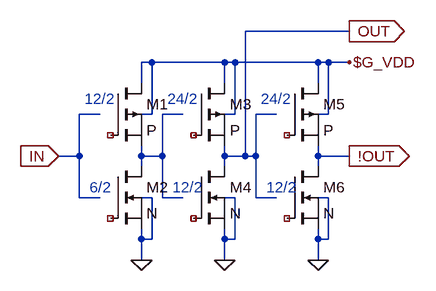
[diagram p0: schematic buf2.asc]
buf2.asc, the LTspice schematic file:
Version 4
SHEET 1 1292 836
WIRE -240 -144 -400 -144
WIRE -544 -96 -560 -96
WIRE -432 -96 -544 -96
WIRE -416 -96 -432 -96
WIRE -288 -96 -416 -96
WIRE -272 -96 -288 -96
WIRE -240 -96 -272 -96
WIRE -560 -64 -560 -96
WIRE -432 -64 -432 -96
WIRE -288 -64 -288 -96
WIRE -624 -16 -656 -16
WIRE -544 -16 -544 -96
WIRE -544 -16 -560 -16
WIRE -496 -16 -528 -16
WIRE -416 -16 -416 -96
WIRE -416 -16 -432 -16
WIRE -352 -16 -384 -16
WIRE -272 -16 -272 -96
WIRE -272 -16 -288 -16
WIRE -656 48 -656 -16
WIRE -656 48 -688 48
WIRE -560 48 -560 32
WIRE -528 48 -528 -16
WIRE -528 48 -560 48
WIRE -432 48 -432 32
WIRE -400 48 -400 -144
WIRE -400 48 -432 48
WIRE -384 48 -384 -16
WIRE -384 48 -400 48
WIRE -288 48 -288 32
WIRE -240 48 -288 48
WIRE -560 64 -560 48
WIRE -432 64 -432 48
WIRE -288 64 -288 48
WIRE -656 112 -656 48
WIRE -624 112 -656 112
WIRE -544 112 -560 112
WIRE -528 112 -528 48
WIRE -496 112 -528 112
WIRE -416 112 -432 112
WIRE -384 112 -384 48
WIRE -352 112 -384 112
WIRE -272 112 -288 112
WIRE -560 176 -560 160
WIRE -544 176 -544 112
WIRE -544 176 -560 176
WIRE -432 176 -432 160
WIRE -416 176 -416 112
WIRE -416 176 -432 176
WIRE -288 176 -288 160
WIRE -272 176 -272 112
WIRE -272 176 -288 176
WIRE -560 208 -560 176
WIRE -432 208 -432 176
WIRE -288 208 -288 176
FLAG -560 208 0
FLAG -688 48 IN
IOPIN -688 48 In
FLAG -432 208 0
FLAG -240 48 !OUT
IOPIN -240 48 Out
FLAG -288 208 0
FLAG -240 -96 $G_VDD
FLAG -240 -144 OUT
IOPIN -240 -144 Out
SYMBOL pmos -608 -64 R0
SYMATTR InstName M1
SYMATTR Value2 L=0.6U W=7.2U AS=4.86P AD=13.005P PS=7.2U PD=20.7U
SYMATTR SpiceModel ""
SYMATTR Value P
SYMBOL nmos -608 64 R0
SYMATTR InstName M2
SYMATTR Value2 L=0.6U W=3.6U AS=4.86P AD=7.065P PS=7.2U PD=13.5U
SYMATTR Value N
SYMBOL pmos -480 -64 R0
SYMATTR InstName M3
SYMATTR Value2 l=0.6U w=7.2U ad=13.005P as=4.86P pd=20.7U ps=7.2U m=2
SYMATTR SpiceModel ""
SYMATTR Value P
SYMBOL nmos -480 64 R0
SYMATTR InstName M4
SYMATTR Value2 l=0.6U w=3.6U ad=7.065P as=4.86P pd=13.5U ps=7.2U m=2
SYMATTR Value N
SYMBOL pmos -336 -64 R0
SYMATTR InstName M5
SYMATTR Value2 l=0.6U w=7.2U ad=13.005P as=4.86P pd=20.7U ps=7.2U m=2
SYMATTR SpiceModel ""
SYMATTR Value P
SYMBOL nmos -336 64 R0
SYMATTR InstName M6
SYMATTR Value2 l=0.6U w=3.6U ad=7.065P as=4.86P pd=13.5U ps=7.2U m=2
SYMATTR Value N
TEXT -648 -40 Left 2 ;12/2
TEXT -640 96 Left 2 ;6/2
TEXT -520 -40 Left 2 ;24/2
TEXT -512 96 Left 2 ;12/2
TEXT -376 -40 Left 2 ;24/2
TEXT -368 96 Left 2 ;12/2

The netlist it stands for:
* buf2.asc
* M1: P L=0.6U W=7.2U AS=4.86P AD=13.005P PS=7.2U PD=20.7U (symbol pmos not certain, pin order unknown); nets seen at it: $G_VDD, N001
* M2: N L=0.6U W=3.6U AS=4.86P AD=7.065P PS=7.2U PD=13.5U (symbol nmos not certain, pin order unknown); nets seen at it: 0, N001
* M3: P l=0.6U w=7.2U ad=13.005P as=4.86P pd=20.7U ps=7.2U m=2 (symbol pmos not certain, pin order unknown); nets seen at it: $G_VDD, OUT
* M4: N l=0.6U w=3.6U ad=7.065P as=4.86P pd=13.5U ps=7.2U m=2 (symbol nmos not certain, pin order unknown); nets seen at it: 0, OUT
* M5: P l=0.6U w=7.2U ad=13.005P as=4.86P pd=20.7U ps=7.2U m=2 (symbol pmos not certain, pin order unknown); nets seen at it: !OUT, $G_VDD
* M6: N l=0.6U w=3.6U ad=7.065P as=4.86P pd=13.5U ps=7.2U m=2 (symbol nmos not certain, pin order unknown); nets seen at it: !OUT, 0
* 12/2
* 6/2
* 24/2
* 12/2
* 24/2
* 12/2
.backanno
.end